# EAGLE design Arduboy flashcart (EAGLE 9.0.0)
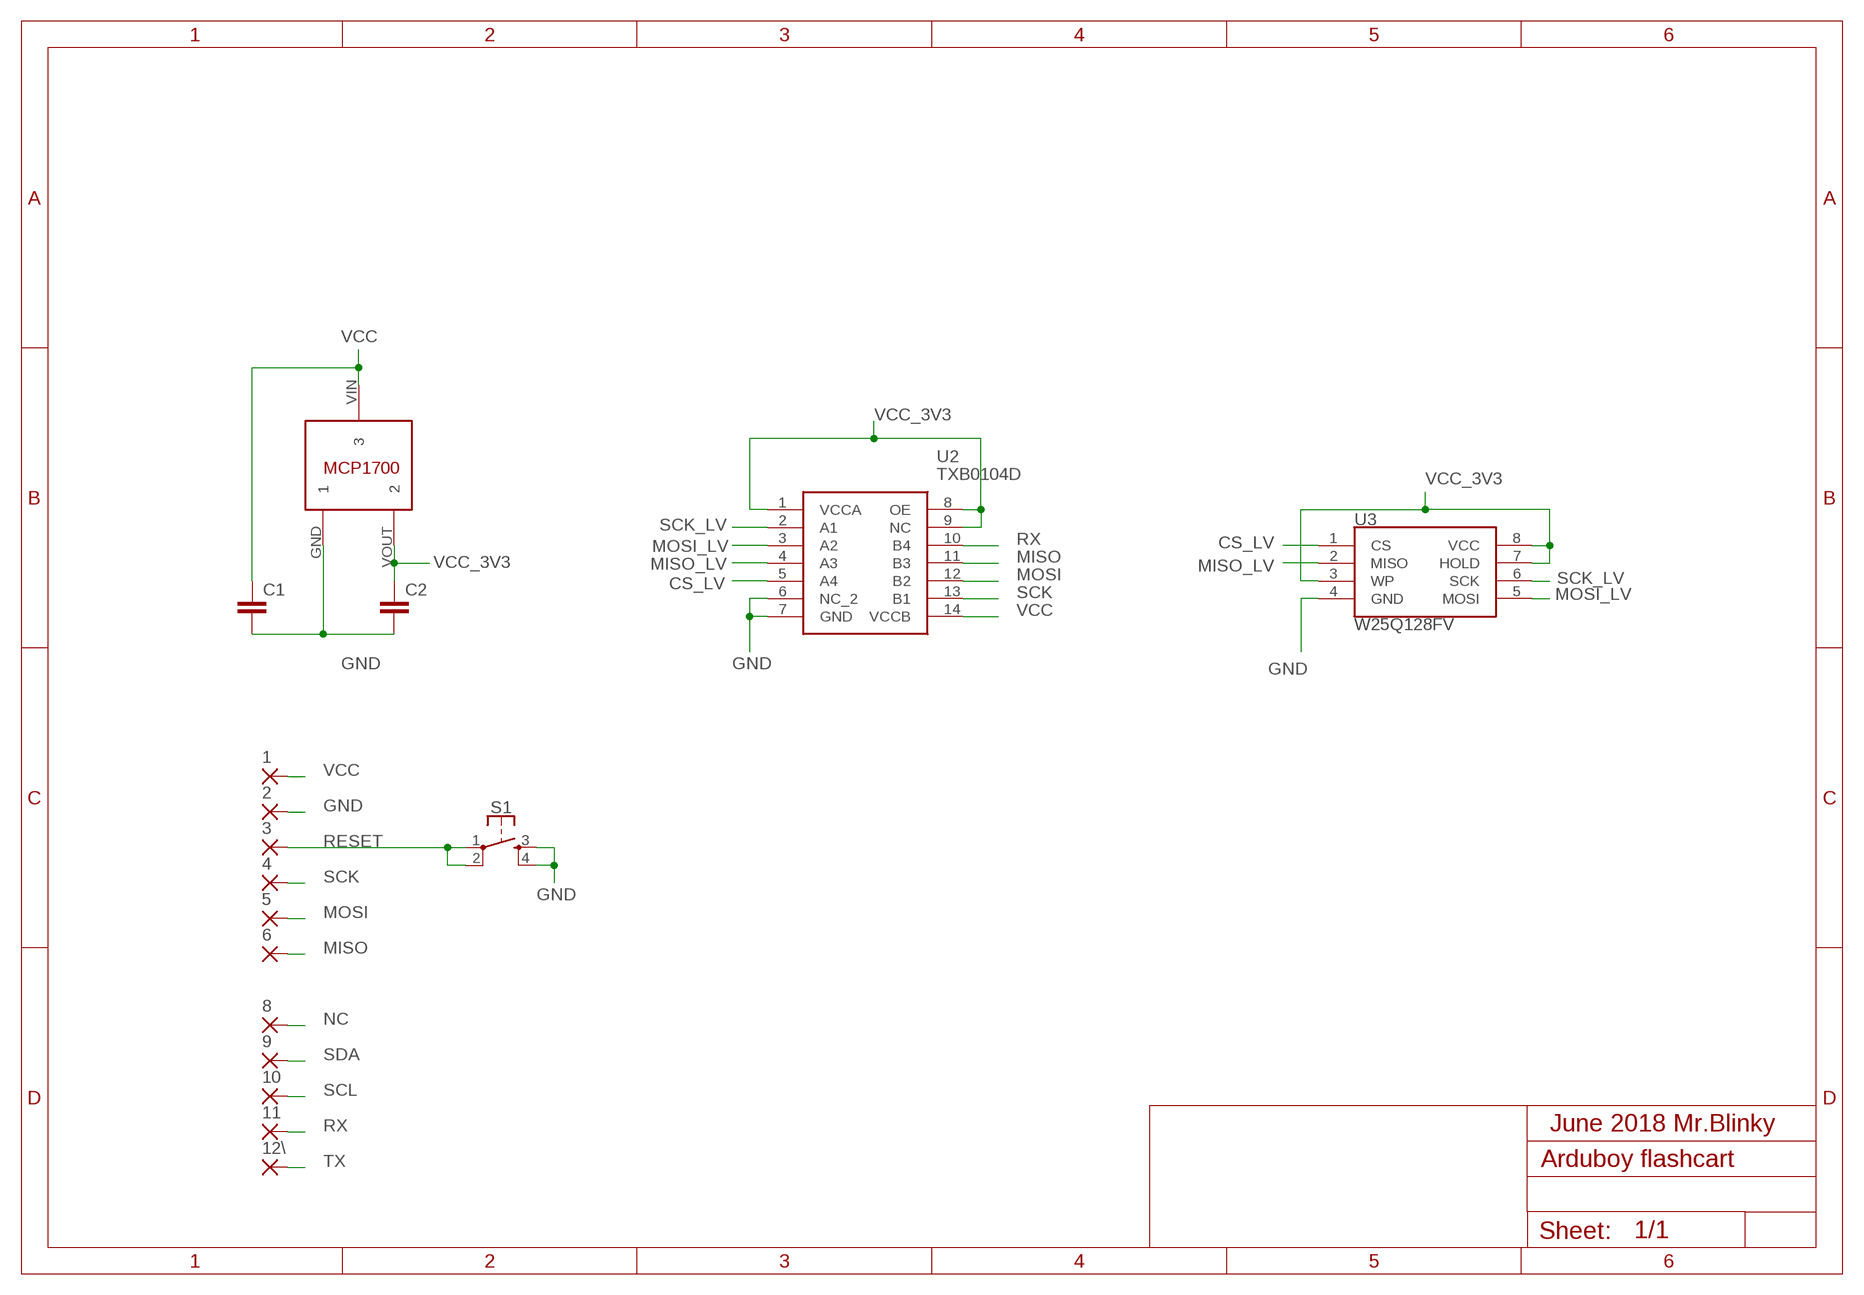
[diagram p0: schematic, sheet 1]

## Parts
1  SMD2  [SMD1,27-2,54]
2  SMD2  [SMD1,27-2,54]
3  SMD2  [SMD1,27-2,54]
4  SMD2  [SMD1,27-2,54]
5  SMD2  [SMD1,27-2,54]
6  SMD2  [SMD1,27-2,54]
8  SMD2  [SMD1,27-2,54]
9  SMD2  [SMD1,27-2,54]
10  SMD2  [SMD1,27-2,54]
11  SMD2  [SMD1,27-2,54]
12\  SMD2  [SMD1,27-2,54]
C1  C-EUC1206  [C1206]
C2  C-EUC1206  [C1206]
S1  MOMENTARY-SWITCH-SPST-2-SMD-5.2MM  [TACTILE_SWITCH_SMD_5.2MM]
U1  MCP1700T-3302E/TT  [MCP1700T-3302E/TT]
U2  TXB0104D  [SOIC127P600X175-14N]
U3  W25Q128FV  SPI_FLASH-X25XXSMD1  [SO08-EIAJ]

## Nets
CS_LV: U2.5(A4) U3.1(CS)
GND: 2.1(P) C1.2 C2.2 S1.3 S1.4 U1.GND U2.6(NC_2) U2.7(GND) U3.4(GND)
MISO: 6.1(P) U2.11(B3)
MISO_LV: U2.4(A3) U3.2(MISO)
MOSI: 5.1(P) U2.12(B2)
MOSI_LV: U2.3(A2) U3.5(MOSI)
NC: 8.1(P)
RESET: 3.1(P) S1.1 S1.2
RX: 11.1(P) U2.10(B4)
SCK: 4.1(P) U2.13(B1)
SCK_LV: U2.2(A1) U3.6(SCK)
SCL: 10.1(P)
SDA: 9.1(P)
TX: 12\.1(P)
VCC: 1.1(P) C1.1 U1.VIN U2.14(VCCB)
VCC_3V3: C2.1 U1.VOUT U2.1(VCCA) U2.8(OE) U2.9(NC) U3.3(WP) U3.7(HOLD) U3.8(VCC)

## Notes on the sheet
- June 2018 Mr.Blinky

## Library data of the parts
1-6 8-11 12\ = wirepad:SMD2: SMD PAD
C1 C2 = rcl:C-EU: CAPACITOR, European symbol; SPICEPREFIX: C
S1 = SparkFun-Switches:MOMENTARY-SWITCH-SPST-2: Momentary Switch (Pushbutton) - SPST - Two Circuits Normally-open (NO) SPST momentary switches (buttons, pushbuttons). Schematic symbol includes two switch circuits. Variants SMD-4.6MMX2.8MM - 4.60mm x 2.80mm Tactile Momentary Button Switch - Used on SparkFun SAMD21 Mini Breakout <https://www.sparkfun.com/products/13664> SMD-5.2MM - Mini Pushbutton Switch - SMD <https://www.sparkfun.com/products/8720> - Used on Arduino Pro Mini <https://www.sparkfun.com/products/11114>; PROD_ID: SWCH-08247; SF_SKU: COM-08720
U1 = MCP1700T-3302E_TT:MCP1700T-3302E/TT: Microchip LDO "MCP1700" in a 3-Pin SOT-23 package. ID: MCP1700T-3302E/TT
U2 = TXB0104D:TXB0104D: 4-BIT BIDIRECTIONAL VOLTAGE-LEVEL TRANSLATOR WITH AUTOMATIC DIRECTION SENSING AND 15-kV ESD PROTECTION Source: Datasheet <http://www.ti.com/lit/gpn/txb0104>; ARROW_PART_NUMBER: TXB0104D; ARROW_PRICE/STOCK: https://www.arrow.com/en/products/txb0104d/texas-instruments; DESCRIPTION: 4-BIT BIDIRECTIONAL VOLTAGE-LEVEL TRANSLATOR WITH AUTOMATIC DIRECTION SENSING AND 15-kV ESD PROTECTION; HEIGHT: mm; MANUFACTURER_NAME: Texas Instruments; MANUFACTURER_PART_NUMBER: TXB0104D; RS_PART_NUMBER: 7092778P; RS_PRICE/STOCK: http://uk.rs-online.com/web/p/products/7092778P
U3 = SparkFun-IC-Memory:SPI_FLASH-X25XX: 32M Serial Flash Memory 8pin SPI Flash series x25xx. Works with devices like W25X32 and BR25L32 Datasheet <http://www.macronix.com/Lists/Datasheet/Attachments/5031/MX25L3206E,%203V,%2032Mb,%20v1.5.pdf> SparkFun Products SparkFun Venus GPS Logger <https://www.sparkfun.com/products/10920> (GPS-10920); PROD_ID: IC-09109; VALUE: 25F32006WSOI

## Board
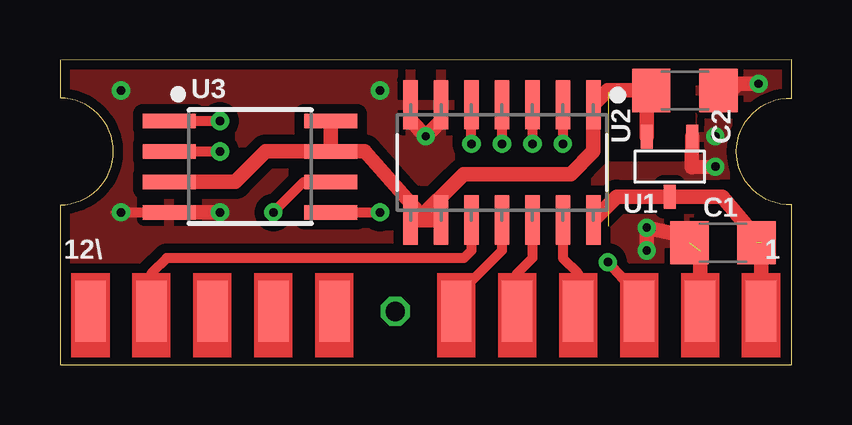
[diagram p1: board, top side]
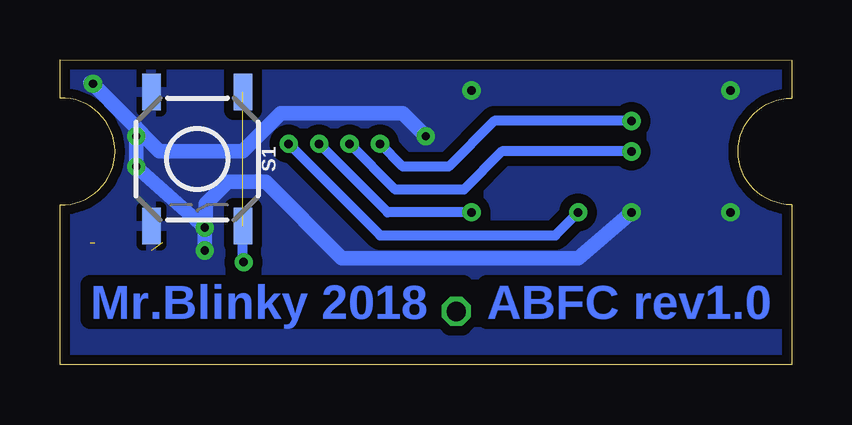
[diagram p2: board, bottom side, seen from below]

Size 30.48 x 12.7 mm. Coordinates in mm from the lower left corner, seen from the top.
Outline: 0,0 30.48,0 30.48,6.67 arc-184 30.48,11.11 30.48,12.7 0,12.69 0,11.11 arc-180 0,6.67 0,0
Copper layers (1*16): Top 0.035mm / dielectric 1.5mm / Bottom 0.035mm
Design rules "default *": minimum track width 6mil, minimum drill 0.35mm, track to track 6mil, track to pad 6mil, pad to pad 6mil, via to via 6mil, smd to smd 6mil, copper to edge 15mil, drill to drill 6mil, minimum pad ring 10mil, minimum via ring 8mil, stop-mask expansion 4mil, vias tented up to drill 0mil, thermal gap 10mil

### Footprints (pad centres in the part's own frame; a part is rotated, then mirrored left to right if it is on the bottom)
SMD1,27-2,54 = smd 1.27 x 2.54: 1 0,0
C1206 = smd 1.6 x 1.8: 1 -1.4,0; 2 1.4,0
TACTILE_SWITCH_SMD_5.2MM = smd 1.524 x 0.762: 1 -2.794,1.905; 2 2.794,1.905; 3 -2.794,-1.905; 4 2.794,-1.905
MCP1700T-3302E/TT = smd 0.5 x 1: GND -0.95,-1.25; VIN 0,1.25; VOUT 0.95,-1.25
SOIC127P600X175-14N = smd 2.057 x 0.61: 1 -4.801,7.62; 2 -4.801,6.35; 3 -4.801,5.08; 4 -4.801,3.81; 5 -4.801,2.54; 6 -4.801,1.27; 7 -4.801,0; 8 0,0; 9 0,1.27; 10 0,2.54; 11 0,3.81; 12 0,5.08; 13 0,6.35; 14 0,7.62
SO08-EIAJ = smd 0.61 x 2.21: 1 -1.905,-3.378; 2 -0.635,-3.378; 3 0.635,-3.378; 4 1.905,-3.378; 5 1.905,3.353; 6 0.635,3.353; 7 -0.635,3.353; 8 -1.905,3.353

### Placement (x,y rotation side)
1  29.21,2.22 0 top
2  26.67,2.22 0 top
3  24.13,2.22 0 top
4  21.59,2.22 0 top
5  19.05,2.22 0 top
6  16.51,2.22 0 top
8  11.43,2.22 0 top
9  8.89,2.22 0 top
10  6.35,2.22 0 top
11  3.81,2.22 0 top
12\  1.27,2.22 0 top
C1  27.62,5.08 180 top
C2  26.04,11.43 0 top
S1  24.77,8.57 270 bottom
U1  25.4,8.26 180 top
U2  14.61,6.03 270 top
U3  7.94,8.26 270 top

### Tracks (layer width: path | path; a pad name or v marks a point on that pad's centre or on a via)
CS_LV  (via drill 0.35)
  Top 0.406: v17.14,9.21 U2.5 | U3.1 v6.67,10.16
  Bottom 0.406: v6.67,10.16 12.38,10.16 14.29,8.26 16.19,8.26 v17.14,9.21
GND  (via drill 0.35)  (1 unrouted)
  Top 0.406: 2.34,6.35 v2.54,6.35 U3.4
  Top 0.61: 2.1 26.67,4.76 | U1.GND 26.33,8.24 v27.3,8.26 | 27.61,11.11 28.23,11.71 v29.11,11.71 | v24.45,4.76 v24.45,5.71 25.91,5.4 C1.2 | U3.4 v6.67,6.35 | U2.7 14.61,10.16 v15.24,9.53 15.88,10.16
  Bottom 0.61: v24.45,5.71 v27.3,8.26 v27.3,9.53 27.3,9.91 v29.11,11.71 | v29.11,11.71 29.14,11.75 29.21,11.75 | v24.45,4.76 v24.45,5.71 | v24.45,5.71 24.4,5.79 24.4,6.72 23.5,7.62 21.91,7.62 18.73,4.45 8.89,4.45 v6.67,6.35 | v29.11,11.71 26.35,8.89 22.86,8.89 21.27,10.48 16.19,10.48 v15.24,9.53
  other vias: 13.34,11.43 2.54,11.43
  pour Bottom (isolate 0.406): 0,12.7 0,0 30.48,0 30.48,12.7
  pour Top (isolate 0.406): 0,12.7 0,4.45 26.04,4.45 26.04,6.35 30.48,6.35 30.48,12.7 26.67,12.7 26.67,8.26 22.86,8.26 22.86,12.7
MISO
  Top 0.406: U2.11 18.41,4.76 16.83,3.18 16.51,3.18
  Top 0.61: 16.51,3.18 6.1
MISO_LV  (via drill 0.35)
  Top 0.406: U2.4 v18.41,9.21 | U3.2 v6.67,8.89
  Bottom 0.406: v6.67,8.89 12.06,8.89 13.65,7.3 16.51,7.3 v18.41,9.21
MOSI
  Top 0.406: U2.12 19.68,4.45 19.05,3.81 5.1
MOSI_LV  (via drill 0.35)
  Top 0.406: U2.3 v19.68,9.21 | U3.5 v13.34,6.35
  Bottom 0.406: v13.34,6.35 16.83,6.35 v19.68,9.21
N$1  (via drill 0.8)
  other vias: 13.97,2.22
RESET  (via drill 0.35)  (1 unrouted)
  Top 0.406: 3.1 24.11,2.86 v22.83,4.28
  Bottom 0.406: 22.76,4.19 v22.83,4.28 22.86,4.15 S1.2
RX
  Top 0.406: U2.10 17.14,4.76 16.83,4.45 4.45,4.45 3.81,3.81 3.81,3.18
  Top 0.61: 3.81,3.18 11.1 3.81,1.96
SCK
  Top 0.406: U2.13 20.95,4.45 21.59,3.81 4.1
SCK_LV  (via drill 0.35)
  Top 0.406: U2.2 v20.95,9.21 | v8.89,6.35 10.16,7.62 U3.6
  Bottom 0.406: v20.95,9.21 17.14,5.4 9.84,5.4 v8.89,6.35
VCC  (1 unrouted)
  Top 0.406: 28.92,5.42
  Top 0.61: U2.14 23.2,7.01 U1.VIN 27.6,7.01 28.92,5.42 29.21,5.08 1.1
VCC_3V3
  Top 0.61: U2.8 15.24,6.03 | 15.24,6.03 U2.9 | U3.3 7.3,7.62 8.57,8.89 U3.7 | U3.8 U3.7 | U3.7 12.7,8.89 15.08,6.21 | 15.08,6.21 15.24,6.03 | 15.08,6.21 16.51,7.62 16.83,7.94 21.27,7.94 22.23,8.89 U2.1 22.82,11.43 C2.1 24.45,11.25 U1.VOUT
(copper drawn outside any net)
  shapes: Top area x11

### Text on the board
Bottom: ABFC rev1.0 | Mr.Blinky 2018
tNames: U1
Reference: 1.2" | 0.5"